# EAGLE design RADIO (EAGLE 9.4.2)
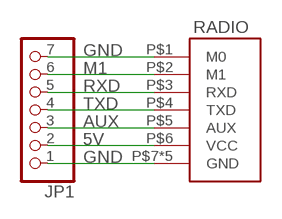
[diagram p0: schematic, sheet 1]

## Parts
JP1  PINHD-1X7  [1X07]
RADIO  RADIO  [RADIO]

## Nets
5V: JP1.2 RADIO.P$6(VCC)
AUX: JP1.3 RADIO.P$5(AUX)
GND: JP1.1 JP1.7 RADIO.P$1(M0) RADIO.P$7(GND) RADIO.P$9(GND) RADIO.P$15(GND) RADIO.P$16(GND) RADIO.P$17(GND)
M1: JP1.6 RADIO.P$2(M1)
RXD: JP1.5 RADIO.P$3(RXD)
TXD: JP1.4 RADIO.P$4(TXD)

## Library data of the parts
JP1 = pinheadCS:PINHD-1X7: PIN HEADER
RADIO = CanCubeSat:RADIO

## Board
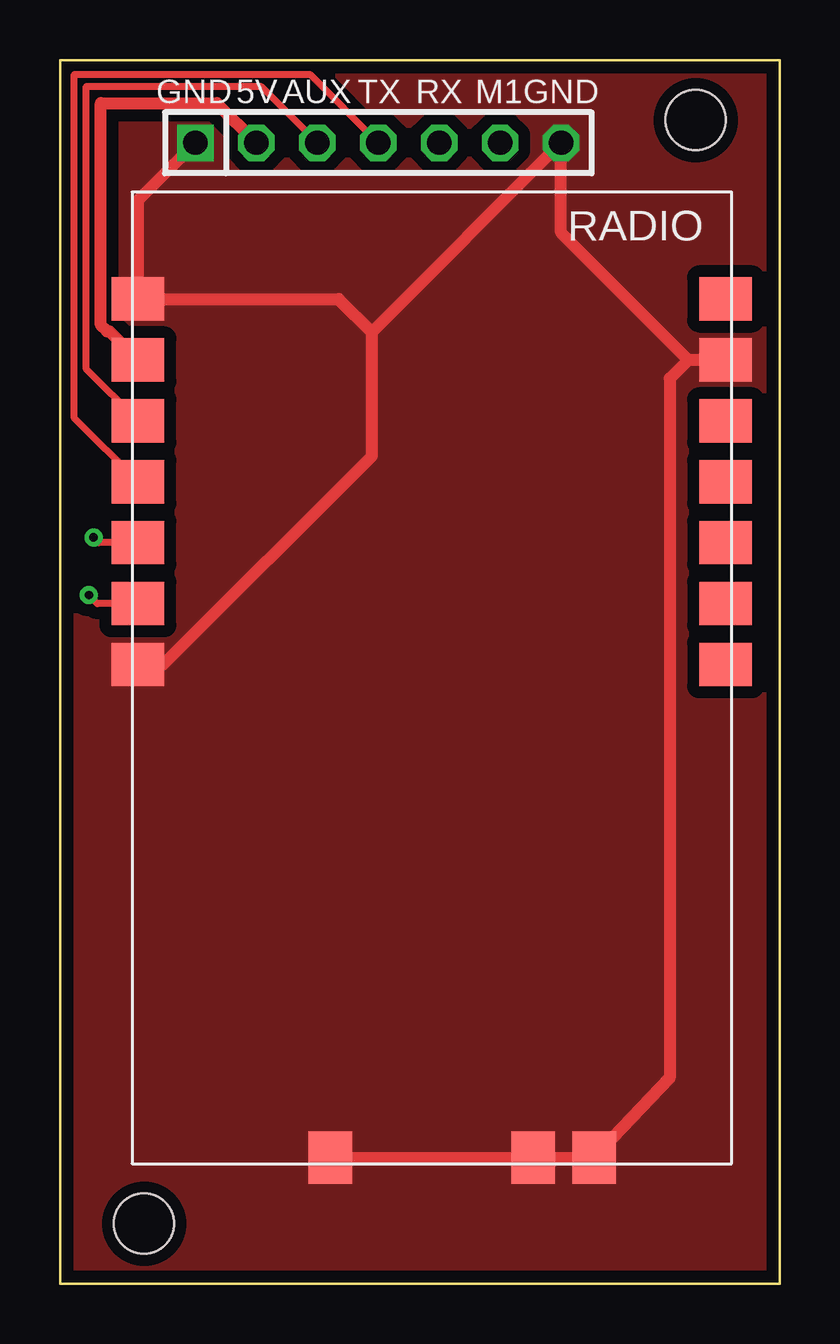
[diagram p1: board, top side]
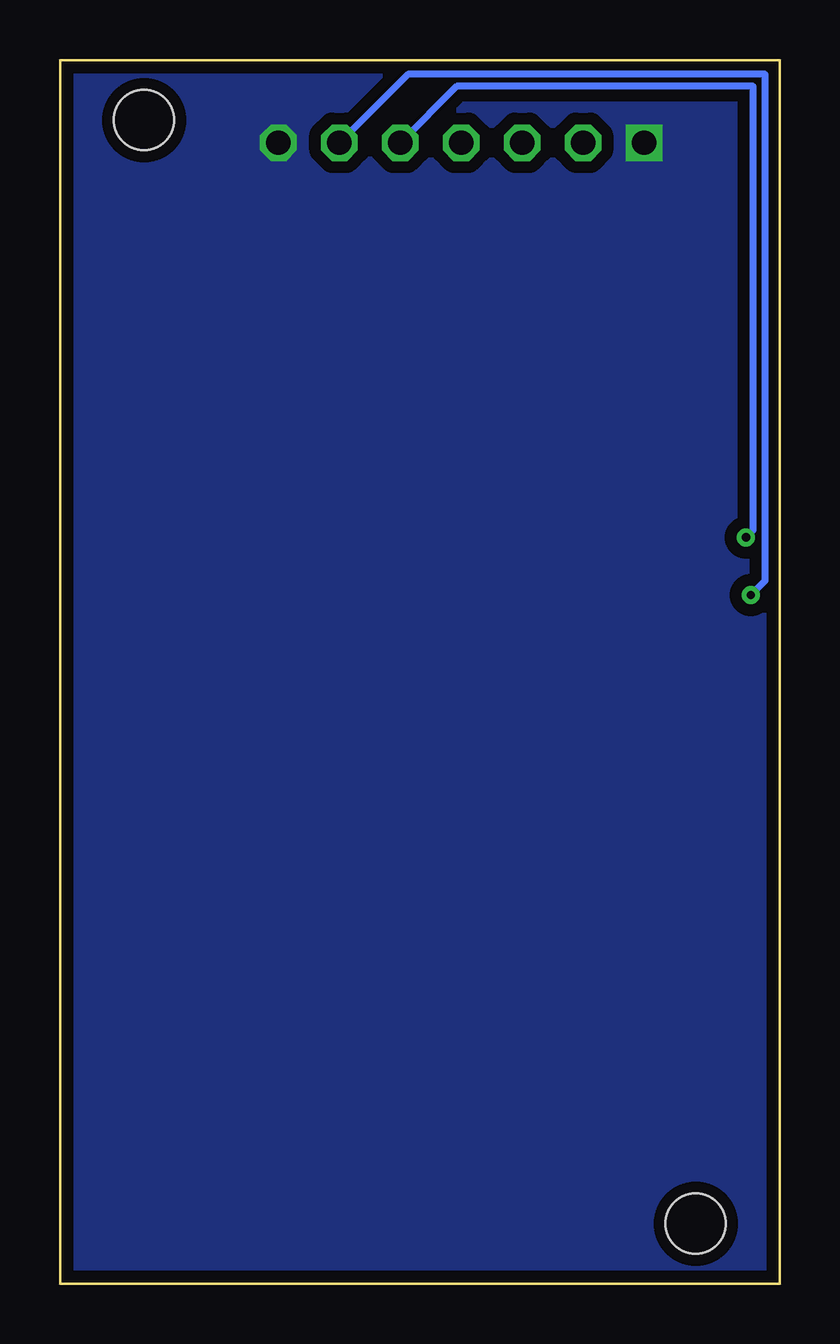
[diagram p2: board, bottom side, seen from below]

Size 30 x 51 mm. Coordinates in mm from the lower left corner, seen from the top.
Outline: 30,0 0,0 0,51 30,51 30,0
Copper layers (1*16): Top 0.035mm / dielectric 1.5mm / Bottom 0.035mm
Design rules "default *": minimum track width 0.3mm, minimum drill 0.35mm, track to track 0.2mm, track to pad 0.2mm, pad to pad 0.2mm, via to via 0.2mm, smd to smd 0.2mm, copper to edge 0.35mm, drill to drill 0.2mm, minimum pad ring 10mil, minimum via ring 8mil, stop-mask expansion 2mil, vias tented up to drill 0mil, thermal gap 10mil
Holes 2.5 mm at 3.5,2.5 26.5,48.5

### Footprints (pad centres in the part's own frame; a part is rotated, then mirrored left to right if it is on the bottom)
1X07 = drill 1.016 square: 1 -7.62,0 | drill 1.016 octagon: 2 -5.08,0; 3 -2.54,0; 4 0,0; 5 2.54,0; 6 5.08,0; 7 7.62,0
RADIO = smd 2.2 x 1.8: P$1 -24.75,20.8; P$2 -24.75,23.34; P$3 -24.75,25.88; P$4 -24.75,28.42; P$5 -24.75,30.96; P$6 -24.75,33.5; P$7 -24.75,36.04; P$8 -0.25,36.04; P$9 -0.25,33.5; P$10 -0.25,30.96; P$11 -0.25,28.42; P$12 -0.25,25.88; P$13 -0.25,23.34; P$14 -0.25,20.8 | smd 1.8 x 2.2: P$15 -5.73,0.25; P$16 -8.27,0.25; P$17 -16.73,0.25

### Placement (x,y rotation side)
JP1  13.27,47.55 0 top
RADIO  28,5 0 top

### Tracks (layer width: path | path; a pad name or v marks a point on that pad's centre or on a via)
5V
  Top 0.5: RADIO.P$6 2.06,39.69 1.96,39.69 1.7,39.95 1.7,49.2 6.54,49.2 JP1.2
AUX
  Top 0.3: RADIO.P$5 1.1,38.11 1.1,49.9 8.38,49.9 JP1.3
GND
  Top 0.5: RADIO.P$17 RADIO.P$16 RADIO.P$15 25.42,8.57 25.42,37.72 26.2,38.5 | RADIO.P$9 26.2,38.5 | 13,39.66 JP1.7 20.89,43.81 26.2,38.5 | RADIO.P$1 4.3,25.8 13,34.5 13,39.66 | JP1.1 3.25,45.15 RADIO.P$7 11.62,41.04 13,39.66
  pour Top (isolate 0.5, no thermals): 0,0 0,51 30,51 30,0
  pour Bottom (isolate 0.5, no thermals): 0,0 0,51 30,51 30,0
M1  (via drill 0.35)
  Top 0.3: RADIO.P$2 1.56,28.34 v1.2,28.7
  Bottom 0.3: v1.2,28.7 0.6,29.3 0.6,50.4 15.5,50.4 JP1.6
RXD  (via drill 0.35)
  Top 0.3: RADIO.P$3 1.62,30.88 v1.4,31.1
  Bottom 0.3: v1.4,31.1 1.1,31.4 1.1,49.9 13.46,49.9 JP1.5
TXD
  Top 0.3: RADIO.P$4 0.6,36.07 0.6,50.4 10.42,50.4 JP1.4

### Text on the board
tNames: GND | 5V | AUX | TX | RX | M1 | GND